# EasyEDA Pro project jlcProject.epro, board PCB7
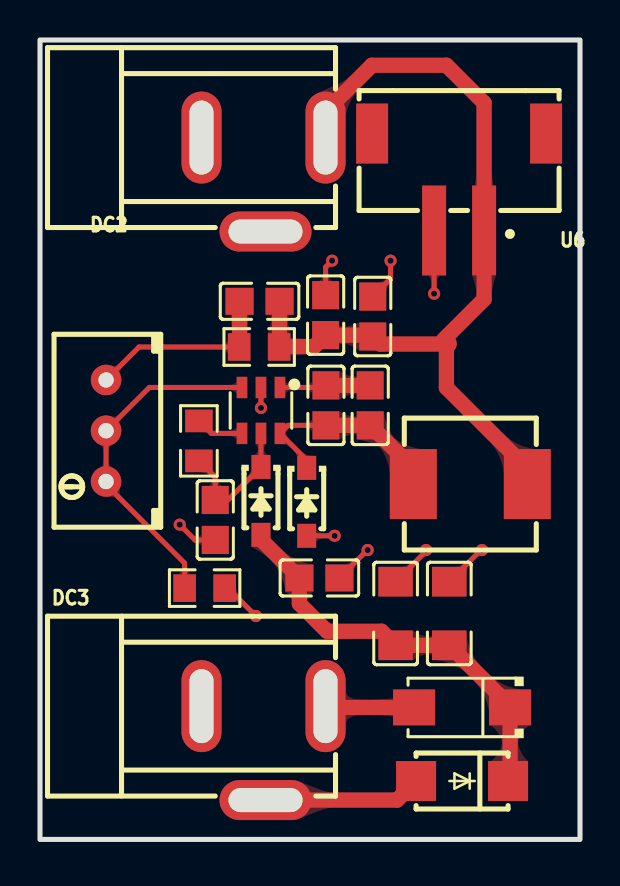
[diagram p9: board, top side]
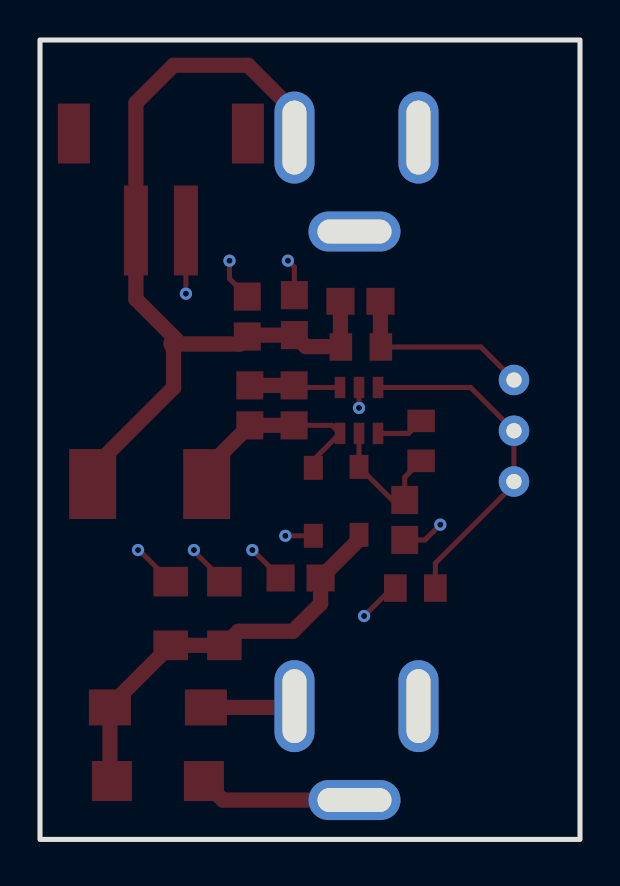
[diagram p10: board, bottom side, seen from below]

Outline 27 x 40 mm; copper layers: Top Layer, Bottom Layer. Coordinates in mm from the lower left corner of the outline.
Outline path: rectangle 0,40 27,0
Stack: Top Layer 0.035mm / Dielectric1 1.51mm FR4 er 4.5 / Bottom Layer 0.035mm

## Design rules (mm)
template: JLCPCB Capability(Two Layers Board)
spacing copperThickness1oz (default): track to track 0.102, other pairs 0.152 to 0.3
spacing copperThickness2oz: track to track 0.203, other pairs 0.152 to 0.3
track width copperThickness1oz (default): min 0.127, default 0.254, max 2.54
track width copperThickness2oz: min 0.203, default 0.254, max 2.54
differential pair differentialPair (default): width min 0.127, default 0.254, max 2.54; gap min 0.152, default 0.152
via viaSize (default): diameter min 0.5, default 0.61, max 10; hole min 0.3, default 0.305, max 6.3

## Placement (name value [footprint] x y rotation side)
ADJ  -  [Mark-Point-1mm]  20.34 24.81 0 top
C3  100uf  [C1206]  20.47 11.3 270 top
C4  100uf  [C1206]  17.78 11.3 270 top
C5  100nF  [C0805]  13.97 13.08 180 top
C6  10uF  [C0805]  8.76 15.98 270 top
C7  10uF  [C0805]  14.28 26.23 270 top
C8  100nF  [C0805]  16.64 26.16 270 top
C9  100nF  [C0805]  14.3 21.72 270 top
C10  100nF  [C0805]  16.51 21.72 270 top
C11  100pF  [C0805]  10.98 26.92 0 top
D1  B5819W SL  [SOD-123_L2.7-W1.6-LS3.7-RD-1]  11.05 16.94 270 top
D2  B5819W SL  [SOD-123_L2.7-W1.6-LS3.7-RD-1]  13.34 16.89 270 top
DC2  DC005  [DC-IN-TH_DC005]  11.18 32.77 0 top
DC3  DC005  [DC-IN-TH_DC005]  11.18 4.32 0 top
R1  1M  [R0805]  7.94 19.94 90 top
R2  4.7K  [R0805]  10.96 24.64 0 top
R3  1.2K  [R0805]  8.23 12.57 180 top
U2  SMAJ15A  [DO-214AC_L4.6-W2.8-LS5.6-RD]  21.1 2.92 180 top
U3  ME3116AM6G  [SOT-23-6_L2.9-W1.6-P0.95-LS2.8-BL]  11.05 21.46 180 top
U4  SS54  [SMA_L4.2-W2.6-LS5.1-RD]  21.1 6.6 180 top
U5  6.8uH  [IND-SMD_L7.2-W6.6_GPSR07X0]  21.51 17.78 0 top
U6  ZX-XH2.54-2PLT  [CONN-SMD_2P-P2.50_HCTL_HC-XH-2ALT]  20.96 32.89 180 top
VR1  -  [RES-ADJ-TH_3296W]  3.3 20.45 180 top

## Footprints (pads in the part's own frame, mm; a bottom-side part is the same pattern mirrored in y, then rotated)
C0805
  rect 1.41x1.35 smd: 1(-1,0) 2(1,0)
C1206
  rect 1.485x1.728 smd: 1(-1.593,0) 2(1.593,0)
CONN-SMD_2P-P2.50_HCTL_HC-XH-2ALT
  rect 1.2x4.5 smd: 1(-1.25,2.425) 2(1.25,2.425)
  rect 1.6x3 smd: 3(4.35,-2.425) 4(-4.35,-2.425)
DC-IN-TH_DC005
  oval 2x4.6 hole 1.2x3.7: 1(3.1,2.35) 2(-3.1,2.35)
  oval 4.6x2 hole 3.7x1.2: 3(0.1,-2.35)
DO-214AC_L4.6-W2.8-LS5.6-RD
  rect 2x2 smd: 1(-2.3,0) 2(2.3,0)
IND-SMD_L7.2-W6.6_GPSR07X0
  rect 2.35x3.5 smd: 1(-2.85,0) 2(2.85,0)
Mark-Point-1mm
  round 1 smd: 1(0,0)
R0805
  rect 1.133x1.377 smd: 1(-1,0) 2(1,0)
RES-ADJ-TH_3296W
  round 1.524 hole 0.762: 1(0,2.54) 2(0,0) 3(0,-2.54)
SMA_L4.2-W2.6-LS5.1-RD
  rect 2.1x1.8 smd: 1(-2.4,0) 2(2.4,0)
SOD-123_L2.7-W1.6-LS3.7-RD-1
  rect 1.2x0.95 smd: 1(-1.7,0) 2(1.7,0)
SOT-23-6_L2.9-W1.6-P0.95-LS2.8-BL
  rect 0.532x1.072 smd: 1(-0.95,-1.149) 2(0,-1.149) 3(0.95,-1.149) 4(0.95,1.149) 5(0,1.149) 6(-0.95,1.149)

## Nets
12V: C3.2 C4.2 C5.2 D1.2 U2.1 U4.1
AGND: C3.1 C4.1 C5.1 C6.2 C7.1 C8.1 D2.2 DC2.2 DC2.3 DC3.2 DC3.3 R3.1 U2.2 U3.2 U6.2
ADJ: ADJ.1 C7.2 C8.2 C11.2 DC2.1 R2.2 U5.2 U6.1
$1N472: R1.2 U3.4
$1N473: C6.1 D1.1 R1.1 U3.5
$1N475: C9.1 C10.1 U3.1
$1N476: C9.2 C10.2 D2.1 U3.6 U5.1
$1N1436: DC3.1 U4.2
$1N1969: C11.1 R2.1 VR1.3
$1N1980: R3.2 U3.3 VR1.1 VR1.2

Pads without a net: U6 3 4

## Via types
v1: diameter 0.61, hole 0.305, Top Layer to Bottom Layer, 10 vias

## Routing (per net, layer and track width the routed paths; a pad name or vN(x,y) marks a point on that pad's centre or on a via; arc(x,y) is an arc through that point)
12V: length 20.7
  Top Layer w0.762: D1.2 11.05,15 C5.2 12.97,11.8 14.35,10.41 17.08,10.41 C4.2 C3.2 23.5,6.67 U4.1 23.5,3.02 U2.1
AGND: length 28.3
  Top Layer w0.254: C8.1 17.53,28.05 v1(17.53,28.96) ; v1(16.38,14.48) 16.37,14.48 C5.1 ; U3.2 v1(11.05,21.59) ; C6.2 7.75,14.98 v1(6.99,15.75) ; v1(22.1,14.48) 22.05,14.48 C3.1 ; D2.2 v1(14.73,15.19) ; v1(10.79,11.18) 9.4,12.57 R3.1 ; C7.1 14.28,28.63 v1(14.6,28.96) ; C4.1 19.3,14.42 v1(19.3,14.48) ; U6.2 v1(19.71,27.31)
  Top Layer w0.762: U2.2 17.85,1.97 DC3.3
ADJ: length 43.4
  Top Layer w0.762: 20.32,24.79 17.01,24.79 C8.2 16.57,25.23 C7.2 13.71,24.66 11.98,24.66 ; 20.32,24.79 ADJ.1 ; 20.32,24.79 20.32,22.61 24.37,18.56 U5.2 ; 20.19,25.02 22.21,27.03 U6.1 22.21,36.85 20.32,38.73 16.59,38.73 14.28,36.42 DC2.1 ; C11.2 11.98,24.66 ; 11.98,24.66 R2.2
$1N472: length 2.4
  Top Layer w0.254: R1.2 8.57,20.31 U3.4
$1N473: length 6.9
  Top Layer w0.254: U3.5 D1.1 9.39,16.98 C6.1 8.76,18.12 R1.1
$1N475: length 4.6
  Top Layer w0.254: C9.1 14.19,22.61 U3.1
  Top Layer w0.762: C10.1 C9.1
$1N476: length 10.8
  Top Layer w0.254: C9.2 12.4,20.72 U3.6 13.34,18.98 D2.1
  Top Layer w0.762: C9.2 C10.2 18.66,18.56 U5.1
$1N1436: length 4.5
  Top Layer w0.762: U4.2 14.34,6.6 DC3.1
$1N1969: length 9.6
  Top Layer w0.254: R2.1 4.95,24.64 VR1.3
  Top Layer w0.762: R2.1 9.98,24.66 C11.1
$1N1980: length 17.2
  Top Layer w0.254: R3.2 7.23,13.82 3.3,17.75 VR1.1 VR1.2 5.47,22.61 U3.3

## Copper pours and planes (outline as drawn; the poured copper is in the pictures)
AGND on Bottom Layer: -1.91,42.67 31.24,42.67 36.07,37.85 36.07,0.76 -5.46,-5.21 -1.91,29.59

Small or netless copper shapes (teardrops, artwork), in the pictures only: 70 on Top Layer
